# Altium schematic sheet SDEC944-xD_Ethernet.SchDoc: Ethernet
size 393 x 270 mm; CompanyName: Seccom; Address1: 521, rue du capt. François Garbit; Address2: 69440 Mornant; Address3: seccom@seccom.fr; Address4: www.seccom.fr; DocumentNumber: 6; SheetNumber: 6; SheetTotal: 22; PageSetup: Record=PageOptions|CenterHorizontal=True|CenterVertical=True|PrintScale=0.74|XCorrection=1.00|YCorrection=1.00|PrintKind=0|BorderSize=5000000|LeftOffset=0|BottomOffset=0|Orientation=2|PaperLength=1000|PaperWidth=1000|Scale=100|PaperSource=7|PrintQuality=-4|MediaType=1|DitherType=10|PaperKind=A4|PrintScaleMode=1
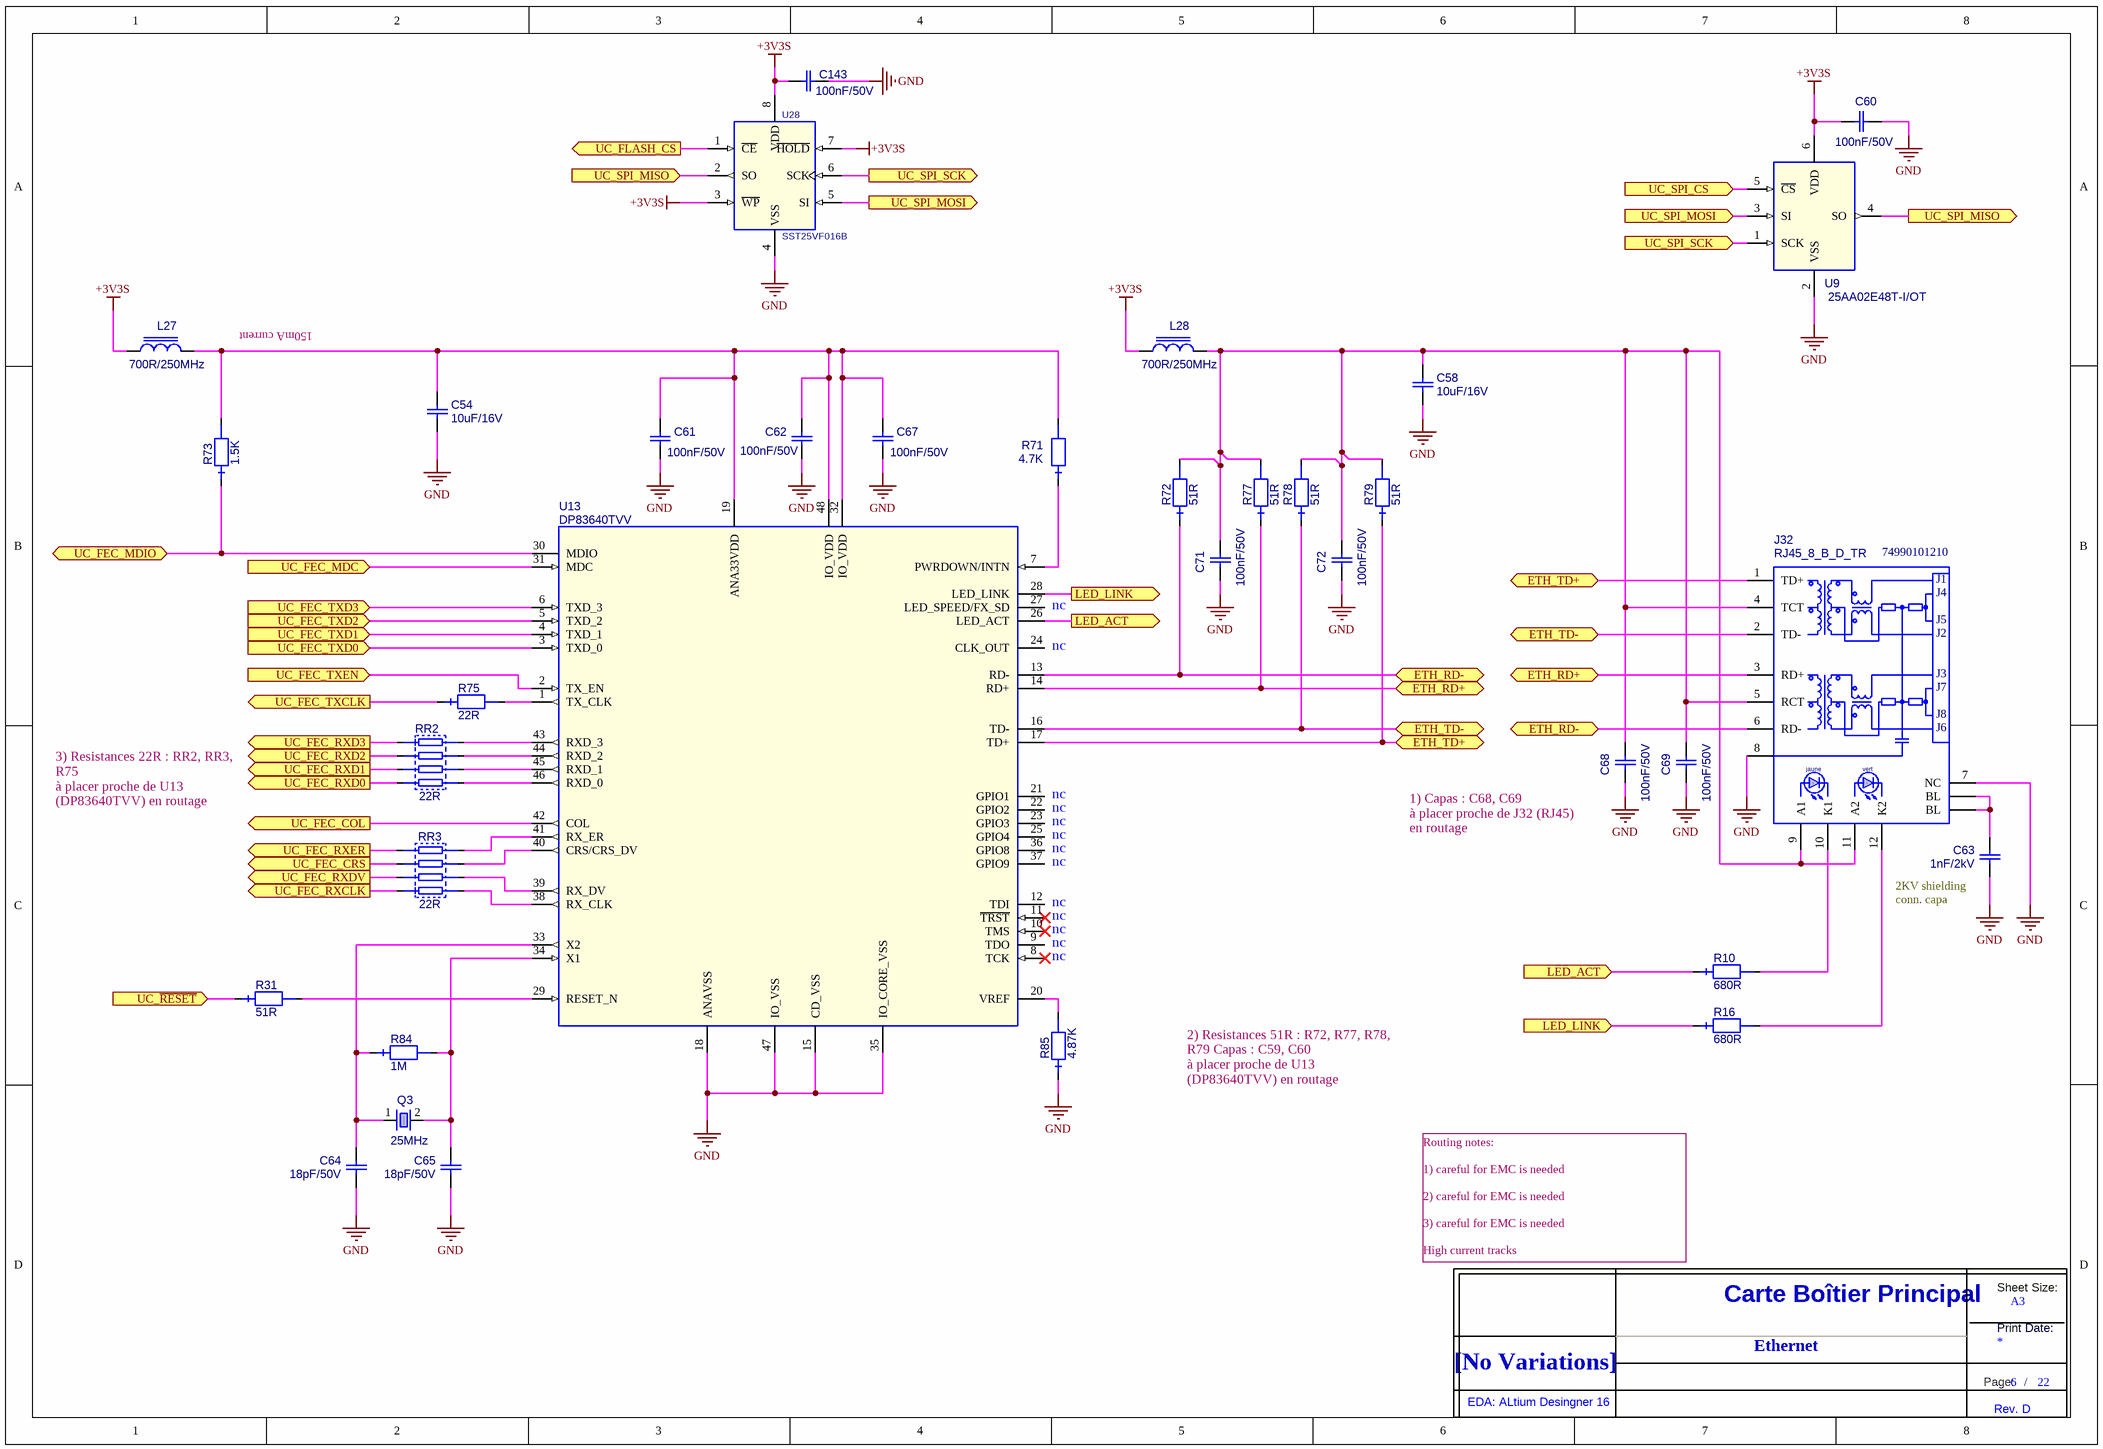
[diagram p0: SDEC944-xD_Ethernet.SchDoc]

## Parts
C54  value 10uF/16V  [0805_ReflowSoldering_CAP]  (hidden comment: C_0805_X5R_10%_10U-16V)
C58  value 10uF/16V  [0805_ReflowSoldering_CAP]  (hidden comment: C_0805_X5R_10%_10U-16V)
C60  value 100nF/50V  [0603_ReflowSoldering_CAP]  (hidden comment: C_0603_X7R_10%_100N-50V)
C61  value 100nF/50V  [0603_ReflowSoldering_CAP]  (hidden comment: C_0603_X7R_10%_100N-50V)
C62  value 100nF/50V  [0603_ReflowSoldering_CAP]  (hidden comment: C_0603_X7R_10%_100N-50V)
C63  value 1nF/2kV  [1206_ReflowSoldering_CAP]  (hidden comment: C_1206_X7R_10%_1N-2KV)
C64  value 18pF/50V  [0603_ReflowSoldering_CAP]  (hidden comment: C_0603_NPO_5%_18P-50V)
C65  value 18pF/50V  [0603_ReflowSoldering_CAP]  (hidden comment: C_0603_NPO_5%_18P-50V)
C67  value 100nF/50V  [0603_ReflowSoldering_CAP]  (hidden comment: C_0603_X7R_10%_100N-50V)
C68  value 100nF/50V  [0603_ReflowSoldering_CAP]  (hidden comment: C_0603_X7R_10%_100N-50V)
C69  value 100nF/50V  [0603_ReflowSoldering_CAP]  (hidden comment: C_0603_X7R_10%_100N-50V)
C71  value 100nF/50V  [0603_ReflowSoldering_CAP]  (hidden comment: C_0603_X7R_10%_100N-50V)
C72  value 100nF/50V  [0603_ReflowSoldering_CAP]  (hidden comment: C_0603_X7R_10%_100N-50V)
C143  value 100nF/50V  [0603_ReflowSoldering_CAP]  (hidden comment: C_0603_X7R_10%_100N-50V)
J32  value RJ45_8_B_D_TR  Ref Fab: 74990101210  [RJ45_8_B_D_TR_74990101210]  (hidden comment: PORT_ETH_10-100-BT_RJ45-8_B_D_LED_TR_74990101210)
L27  value 700R/250MHz  [0603_ReflowSoldering_CAP]  (hidden comment: IND_FERRITE_0603_742792643)
L28  value 700R/250MHz  [0603_ReflowSoldering_CAP]  (hidden comment: IND_FERRITE_0603_742792643)
Q3  value 25MHz  [QUARTZ_HC49_11.5X5_CMS]  (hidden comment: QUARTZ_HC49/4HSMX_25M)
R10  value 680R  [0603_ReflowSoldering_RES]  (hidden comment: RES_0603_1%_100PPM_680R)
R16  value 680R  [0603_ReflowSoldering_RES]  (hidden comment: RES_0603_1%_100PPM_680R)
R31  value 51R  [0603_ReflowSoldering_RES]  (hidden comment: RES_0603_1%_100PPM_51R)
R71  value 4.7K  [0603_ReflowSoldering_RES]  (hidden comment: RES_0603_1%_100PPM_4.7K)
R72  value 51R  [0603_ReflowSoldering_RES]  (hidden comment: RES_0603_1%_100PPM_51R)
R73  value 1.5K  [0603_ReflowSoldering_RES]  (hidden comment: RES_0603_1%_100PPM_1.5K)
R75  value 22R  [0603_ReflowSoldering_RES]  (hidden comment: RES_0603_1%_100PPM_22R)
R77  value 51R  [0603_ReflowSoldering_RES]  (hidden comment: RES_0603_1%_100PPM_51R)
R78  value 51R  [0603_ReflowSoldering_RES]  (hidden comment: RES_0603_1%_100PPM_51R)
R79  value 51R  [0603_ReflowSoldering_RES]  (hidden comment: RES_0603_1%_100PPM_51R)
R84  value 1M  [0603_ReflowSoldering_RES]  (hidden comment: RES_0603_1%_100PPM_1M)
R85  value 4.87K  [0603_ReflowSoldering_RES]  (hidden comment: RES_0603_1%_100PPM_4.87K)
RR2  value 22R  [ARV241]  (hidden comment: RES_4XR0603_IND_5%_22R*)
RR3  value 22R  [ARV241]  (hidden comment: RES_4XR0603_IND_5%_22R*)
Title_new  DNI  (value not drawn)  (graphical)
U9  25AA02E48T-I/OT  [SOT23_6L]
U13  DP83640TVV  [QFP_048_E0,50_7X7MM]
U28  value SST25VF016B  [SOIC_08_E1.27_L200_REFLOWSOLDERING]  (hidden comment: SST25VF016B-50-4I-S2AF)

## Ports
ETH_RD+ (bidir), ETH_RD- (bidir), ETH_TD+ (bidir), ETH_TD- (bidir), LED_ACT (in), LED_ACT (out), LED_LINK (in), LED_LINK (out), UC_FEC_COL (out), UC_FEC_CRS (out), UC_FEC_MDC (in), UC_FEC_MDIO (bidir), UC_FEC_RXCLK (out), UC_FEC_RXD0 (out), UC_FEC_RXD1 (out), UC_FEC_RXD2 (out), UC_FEC_RXD3 (out), UC_FEC_RXDV (out), UC_FEC_RXER (out), UC_FEC_TXCLK (out), UC_FEC_TXD0 (in), UC_FEC_TXD1 (in), UC_FEC_TXD2 (in), UC_FEC_TXD3 (in), UC_FEC_TXEN (in), UC_FLASH_CS (out), UC_SPI_CS (in), UC_SPI_MISO (in), UC_SPI_MISO (out), UC_SPI_MOSI (in), UC_SPI_MOSI (out), UC_SPI_SCK (in), UC_SPI_SCK (out), UC_~{RESET} (in)

## Nets
+3V3S: C60.1 C143.1 L27.1 L28.1 U9.6(VDD) U28.3(~{WP}) U28.7(~{HOLD}) U28.8(VDD)
GND: C54.1 C58.1 C60.2 C61.2 C62.2 C63.1 C64.1 C65.1 C67.2 C68.2 C69.2 C71.2 C72.2 C143.2 J32.7(NC) J32.8 R85.1 U9.2(VSS) U13.15(CD_VSS) U13.18(ANAVSS) U13.35(IO_CORE_VSS) U13.47(IO_VSS) U28.4(VSS)
ETH_RD+: J32.3(RD+) R77.1 U13.14(RD+) ; port ETH_RD+
ETH_RD-: J32.6(RD-) R72.1 U13.13(RD-) ; port ETH_RD-
ETH_TD+: J32.1(TD+) R79.1 U13.17(TD+) ; port ETH_TD+
ETH_TD-: J32.2(TD-) R78.1 U13.16(TD-) ; port ETH_TD-
LED_ACT: R10.1 U13.26(LED_ACT) ; port LED_ACT
LED_LINK: R16.1 U13.28(LED_LINK) ; port LED_LINK
UC_FEC_COL: U13.42(COL) ; port UC_FEC_COL
UC_FEC_CRS: RR3.5 ; port UC_FEC_CRS
UC_FEC_MDC: U13.31(MDC) ; port UC_FEC_MDC
UC_FEC_MDIO: R73.1 U13.30(MDIO) ; port UC_FEC_MDIO
UC_FEC_RXCLK: RR3.1 ; port UC_FEC_RXCLK
UC_FEC_RXD0: RR2.7 ; port UC_FEC_RXD0
UC_FEC_RXD1: RR2.5 ; port UC_FEC_RXD1
UC_FEC_RXD2: RR2.3 ; port UC_FEC_RXD2
UC_FEC_RXD3: RR2.1 ; port UC_FEC_RXD3
UC_FEC_RXDV: RR3.3 ; port UC_FEC_RXDV
UC_FEC_RXER: RR3.7 ; port UC_FEC_RXER
UC_FEC_TXCLK: R75.1 ; port UC_FEC_TXCLK
UC_FEC_TXD0: U13.3(TXD_0) ; port UC_FEC_TXD0
UC_FEC_TXD1: U13.4(TXD_1) ; port UC_FEC_TXD1
UC_FEC_TXD2: U13.5(TXD_2) ; port UC_FEC_TXD2
UC_FEC_TXD3: U13.6(TXD_3) ; port UC_FEC_TXD3
UC_FEC_TXEN: U13.2(TX_EN) ; port UC_FEC_TXEN
UC_FLASH_CS: U28.1(~{CE}) ; port UC_FLASH_CS
UC_~{RESET}: R31.1 ; port UC_~{RESET}
UC_SPI_CS: U9.5(~{CS}) ; port UC_SPI_CS
UC_SPI_MISO: U9.4(SO) U28.2(SO) ; port UC_SPI_MISO
UC_SPI_MOSI: U9.3(SI) U28.5(SI) ; port UC_SPI_MOSI
UC_SPI_SCK: U9.1(SCK) U28.6(SCK) ; port UC_SPI_SCK
NetC54_2: C54.2 C61.1 C62.1 C67.1 L27.2 R71.2 R73.2 U13.19(ANA33VDD) U13.32(IO_VDD) U13.48(IO_VDD)
NetC58_2: C58.2 C68.1 C69.1 C71.1 C72.1 J32.4(TCT) J32.5(RCT) J32.9(A1) J32.11(A2) L28.2 R72.2 R77.2 R78.2 R79.2
NetC63_2: C63.2 J32.FIX1(BL) J32.FIX2(BL)
NetC64_2: C64.2 Q3.1 R84.1 U13.33(X2)
NetC65_2: C65.2 Q3.2 R84.2 U13.34(X1)
NetJ32_10: J32.10(K1) R10.2
NetJ32_12: J32.12(K2) R16.2
NetR31_2: R31.2 U13.29(RESET_N)
NetR71_1: R71.1 U13.7(PWRDOWN/INTN)
NetR75_2: R75.2 U13.1(TX_CLK)
NetR85_2: R85.2 U13.20(VREF)
NetRR2_2: RR2.2 U13.43(RXD_3)
NetRR2_4: RR2.4 U13.44(RXD_2)
NetRR2_6: RR2.6 U13.45(RXD_1)
NetRR2_8: RR2.8 U13.46(RXD_0)
NetRR3_2: RR3.2 U13.38(RX_CLK)
NetRR3_4: RR3.4 U13.39(RX_DV)
NetRR3_6: RR3.6 U13.40(CRS/CRS_DV)
NetRR3_8: RR3.8 U13.41(RX_ER)

Not connected (* = marked no-connect by the designer): U13 8(TCK)* 9(TDO) 10(TMS)* 11(~{TRST})* 12(TDI) 21(GPIO1) 22(GPIO2) 23(GPIO3) 24(CLK_OUT) 25(GPIO4) 27(LED_SPEED/FX_SD) 36(GPIO8) 37(GPIO9)

## Notes on the sheet
- (near L27) 150mA current
- (near U13) nc
- 3) Resistances 22R : RR2, RR3, R75
  à placer proche de U13 (DP83640TVV) en routage
- (near C68) 1) Capas : C68, C69
  à placer proche de J32 (RJ45) en routage
- (near C63) 2KV shielding
  conn. capa
- 2) Resistances 51R : R72, R77, R78, R79 Capas : C59, C60
  à placer proche de U13 (DP83640TVV) en routage
- Routing notes:
  1) careful for EMC is needed
  2) careful for EMC is needed
  3) careful for EMC is needed
  High current tracks
- Ethernet
- (in symbol PORT_ETH_10-100-BT_RJ45-8_B_D_LED_TR_74990101210) J1; J4; J5; J2; J3; J7; J8; J6; jaune; vert
- (in symbol Title_new) Sheet Size:; Carte Boîtier Principal; A3; Print Date:; [No Variations]; Page:; /; EDA: ALtium Desingner 16; Rev. D

## Library data of the parts
C54 C58 = C_0805_X5R_10%_10U-16V: Condensateur céramique, X5R, 10%, CMS 0805, 10uF/16V; Creation: FB (02/10/12); Boitier: 0805; Remarque: {Remarque}; Coeff: 1; Fabricant: Kemet; Ref Fab: C0805C106K4PAC; Verification: *; ComponentLink1URL: O:\_Documentation\Datasheets\Kemet\Condos_Ceramic_CMS.pdf; ComponentLink2URL: o:\_Documentation\Datasheets\_Boitiers\PASSIF_CMS\RC_0805_(2x1,25)_(Schneider).pdf; Config: *; ComponentLink1Description: Datasheet; ComponentLink2Description: Datasheet Boitier
C60-C62 C67-C69 C71 C72 C143 = C_0603_X7R_10%_100N-50V: Condensateur céramique, X7R, 10%, CMS 0603, 100nF/50V; Creation: FB (29/02/12); Boitier: 0603; Remarque: {Remarque}; Fabricant: Kemet; Ref Fab: C0603C104K5RAC; Coeff: 1; ComponentLink1URL: O:\_Documentation\Datasheets\Kemet\Condos_Ceramic_CMS.pdf; ComponentLink2URL: o:\_Documentation\Datasheets\_BOITIERS\PASSIF_CMS\; Config: *; ComponentLink1Description: Datasheet; ComponentLink2Description: Datasheet Boitier; Supplier 1: Farnell; Supplier Part Number 1: 1288255
C63 = C_1206_X7R_10%_1N-2KV: Condensateur céramique, X7R, 10%, CMS 1206; Creation: LJ (29/06/10); Reference: 001425/00; Boitier: 1206; Remarque: {Remarque}; Coeff: 1; Fabricant: Kemet; Ref Fab: C1206C102KGRAC; ComponentLink1URL: O:\_Documentation\Datasheets\Kemet\Condos_Ceramic_HighVoltage_CMS.pdf; ComponentLink2URL: o:\_Documentation\Datasheets\_Boitiers\PASSIF_CMS\; Config: *; ComponentLink1Description: Datasheet; ComponentLink2Description: Datasheet Boitier
C64 C65 = C_0603_NPO_5%_18P-50V: Condensateur céramique, NPO, 5%, CMS 0603, 18pF/50V; Creation: FB (04/07/12); Boitier: 0603; Remarque: {Remarque}; Fabricant: Kemet; Ref Fab: C0603C180J5GAC; Coeff: 1; ComponentLink2URL: o:\_Documentation\Datasheets\_BOITIERS\PASSIF_CMS\; Config: *; ComponentLink1Description: Datasheet; ComponentLink2Description: Datasheet Boitier; Supplier 1: Farnell; Supplier Part Number 1: 1414620
J32 = PORT_ETH_10-100-BT_RJ45-8_B_D_LED_TR_74990101210: Embase RJ45 avec transformateur, 8/8 contacts + Led verte et jaune, blindée, droit, Viso 1.5kV; Creation: JPL (05/07/12); Coeff: 1; Fabricant: Wurth Electronik; Boitier: RJ45_8_B_D_TR; Config: *; ComponentLink1Description: Datasheet; ComponentLink2Description: Datasheet Boitier
L27 L28 = IND_FERRITE_0603_742792643: Inductance à ferrite multicouches CMS, imp=700R@250MHz, +/-25%, Rdc=350mR, I=400mA; Creation: PDP (02/08/12); Boitier: 0603; Coeff: 1; Fabricant: Wurth Elektronik; ComponentLink1URL: o:\_Documentation\Datasheets\Murata\Ferrite_BLM21P.pdf; Config: *; ComponentLink1Description: Datasheet; ComponentLink2Description: Datasheet Boitier; Ref Fab: 742792643; Supplier 1: Farnell; Supplier Part Number 1: 1800349
Q3 = QUARTZ_HC49/4HSMX_25M: Quartz CMS série HCM49 (équiv HC49/US), -10/+60°C, +/-30ppm, 18pF; Creation: LJ (11/03/09); Reference: 000495/00; Fabricant: Citizen; Ref Fab: HCM49 25.000MABJ-UT; Coeff: 1; Verification: *; Boitier: HC49/4HSMX; Remarque: *; ComponentLink1URL: O:\_Documentation\Datasheets\Citizen\Quartz_HC49-US_HCM49.pdf; ComponentLink2URL: o:\_Documentation\Datasheets\_BOITIERS\; Config: *; ComponentLink1Description: Datasheet; ComponentLink2Description: Datasheet Boitier; Supplier 1: Farnell; Supplier 2: Mouser; Supplier Part Number 1: 1457105; Supplier Part Number 2: 695-HCM49-25-U
R10 R16 = RES_0603_1%_100PPM_680R: Résistance, 0.100W, 1%, 100ppm, 75V, 680R; Creation: FB (02/08/12); Boitier: 0603; Remarque: {Remarque}; Fabricant: Vishay; Ref Fab: CRCW0603680RFKEA; Coeff: 1; Verification: *; ComponentLink1URL: O:\_Documentation\Datasheets\Vishay\Resistances_D-CRCWe3.pdf; ComponentLink2URL: o:\_Documentation\Datasheets\_BOITIERS\PASSIF_CMS\; Config: *; ComponentLink1Description: Datasheet; ComponentLink2Description: Datasheet Boitier; Supplier 1: Farnell; Supplier Part Number 1: 1469834; Supplier 2: Mouser; Supplier Part Number 2: 71-CRCW0603-680-E3
R31 R72 R77-R79 = RES_0603_1%_100PPM_51R: Résistance, 0.100W, 1%, 100ppm, 75V, 51R; Creation: JPL (05/07/12); Boitier: 0603; Remarque: {Remarque}; Fabricant: Vishay; Ref Fab: CRCW060351R0FKEA; Coeff: 1; Verification: *; ComponentLink1URL: O:\_Documentation\Datasheets\Vishay\Resistances_D-CRCWe3.pdf; ComponentLink2URL: o:\_Documentation\Datasheets\_BOITIERS\PASSIF_CMS\; Config: *; ComponentLink1Description: Datasheet; ComponentLink2Description: Datasheet Boitier; Supplier 1: Farnell; Supplier 2: Mouser; Supplier Part Number 1: 1652889; Supplier Part Number 2: 71-CRCW0603-51-E3
R71 = RES_0603_1%_100PPM_4.7K: Résistance, 0.100W, 1%, 100ppm, 75V, 4.7K; Creation: JPL (05/07/12); Boitier: 0603; Remarque: {Remarque}; Fabricant: Vishay; Ref Fab: CRCW06034K70FKEA; Coeff: 1; Verification: *; ComponentLink1URL: O:\_Documentation\Datasheets\Vishay\Resistances_D-CRCWe3.pdf; ComponentLink2URL: o:\_Documentation\Datasheets\_BOITIERS\PASSIF_CMS\; Config: *; ComponentLink1Description: Datasheet; ComponentLink2Description: Datasheet Boitier; Supplier 1: Farnell; Supplier 2: RadioSpares; Supplier Part Number 1: 1469807; Supplier Part Number 2: 6790484
R73 = RES_0603_1%_100PPM_1.5K: Résistance, 0.100W, 1%, 100ppm, 75V, 1.5K; Creation: JPL (05/07/12); Boitier: 0603; Remarque: {Remarque}; Fabricant: Vishay; Ref Fab: CRCW06031K50FKEA; Coeff: 1; Verification: *; ComponentLink1URL: O:\_Documentation\Datasheets\Vishay\Resistances_D-CRCWe3.pdf; ComponentLink2URL: o:\_Documentation\Datasheets\_BOITIERS\PASSIF_CMS\; Config: *; ComponentLink1Description: Datasheet; ComponentLink2Description: Datasheet Boitier; Supplier 1: Farnell; Supplier 2: RadioSpares; Supplier Part Number 1: 1469743; Supplier Part Number 2: 6789908
R75 = RES_0603_1%_100PPM_22R: Résistance, 0.100W, 1%, 100ppm, 75V, 22R; Creation: FB (05/07/12); Boitier: 0603; Remarque: {Remarque}; Fabricant: Vishay; Ref Fab: CRCW060322R0FKEA; Coeff: 1; Verification: *; ComponentLink1URL: O:\_Documentation\Datasheets\Vishay\Resistances_D-CRCWe3.pdf; ComponentLink2URL: o:\_Documentation\Datasheets\_BOITIERS\PASSIF_CMS\; Config: *; ComponentLink1Description: Datasheet; ComponentLink2Description: Datasheet Boitier; Supplier 1: Farnell; Supplier Part Number 1: 1469781
R84 = RES_0603_1%_100PPM_1M: Résistance, 0.100W, 1%, 100ppm, 75V, 1M; Creation: FB (04/07/12); Boitier: 0603; Remarque: {Remarque}; Fabricant: Vishay; Ref Fab: CRCW06031M00FKEA; Coeff: 1; Verification: *; ComponentLink1URL: O:\_Documentation\Datasheets\Vishay\Resistances_D-CRCWe3.pdf; ComponentLink2URL: o:\_Documentation\Datasheets\_BOITIERS\PASSIF_CMS\; Config: *; ComponentLink1Description: Datasheet; ComponentLink2Description: Datasheet Boitier; Supplier 1: Farnell; Supplier Part Number 1: 1469746
R85 = RES_0603_1%_100PPM_4.87K: Résistance, 0.100W, 1%, 100ppm, 75V, 4.87K; Creation: JPL (05/07/12); Boitier: 0603; Remarque: {Remarque}; Fabricant: Vishay; Ref Fab: CRCW06034K87FKEA; Coeff: 1; Verification: *; ComponentLink1URL: O:\_Documentation\Datasheets\Vishay\Resistances_D-CRCWe3.pdf; ComponentLink2URL: o:\_Documentation\Datasheets\_BOITIERS\PASSIF_CMS\; Config: *; ComponentLink1Description: Datasheet; ComponentLink2Description: Datasheet Boitier; Supplier 1: Farnell; Supplier 2: RadioSpares; Supplier Part Number 1: 1692529; Supplier Part Number 2: 6790481
RR2 RR3 = RES_4XR0603_IND_5%_22R*: Réseau de 4 résistances 0603 individuels, 63mW, 5%, CONCAVE / CONVEXE, CMS 1206; Creation: CHD; Reference: 001805/00; Boitier: ARx241; Remarque: {Remarque}; Verification: LJ (07/02/12); Coeff: 1; Fabricant: Yageo; Ref Fab: YC164-JR-0722RL; ComponentLink1URL: o:\_Documentation\Datasheets\Phycomp\ARC-ARV241-242.PDF; ComponentLink2URL: o:\_Documentation\Datasheets\_BOITIERS\; Config: *; ComponentLink1Description: Datasheet; ComponentLink2Description: Datasheet Boitier; Supplier 1: Farnell; Supplier Part Number 1: 9234411
Title_new = Title_new
U9 = 25AA02E48T-I/OT: EEPROM, avec identifiant EUI-48 (adresse MAC), 2kbits, Vs=1.8~5.5V, 10MHz, CMS; Creation: CHD(10/03/09); Verification: LJ; Reference: 000492/00; Coeff: 1; Fabricant: Microchip; Boitier: SOT23_6L; Remarque: *; ComponentLink1URL: o:\_Documentation\Datasheets\MicroChip\25AA02E48.pdf; ComponentLink2URL: o:\_Documentation\Datasheets\_Boitiers\ACTIF_CMS\SOT & TSOT\SOT23_6_(Schneider).pdf; Config: *; ComponentLink1Description: Datasheet; ComponentLink2Description: Datasheet Boitier; Ref Fab: 25AA02E48T-I/OT; Value: 25AA02E48T-I/OT
U13 = DP83640TVV: DP83640 Precision PHYTER - IEEE 1588 Precision Time Protocol Transceiver; Creation: FB (05/07/12); Boitier: LQFP48_e0.50_7x7mm; Remarque: {Remarque}; Coeff: 1; Fabricant: National Semiconductor; Ref Fab: DP83640TVV; ComponentLink1Description: Datasheet; ComponentLink1URL: o:\_Documentation\Datasheets\; ComponentLink2Description: Datasheet Boitier; ComponentLink2URL: o:\_Documentation\Datasheets\_BOITIERS\; Supplier 1: Farnell; Supplier Part Number 1: 1850292; Value: DP83640TVV
U28 = SST25VF016B-50-4I-S2AF: Mémoire Flash SPI, 2MBit, 50MHz, Vs=2.7~3.6V, -40/+85°C, CMS; Creation: PDP (23/04/13); Boitier: SO8_L200; Coeff: 1; Fabricant: Microchip; Verification: *; ComponentLink1URL: O:\_Documentation\Datasheets\MicroChip\SST25VF016B.pdf; ComponentLink2URL: O:\_Documentation\Datasheets\MicroChip\SST25VF016B.pdf; ComponentLink1Description: Datasheet; ComponentLink2Description: Datasheet Boitier; Ref Fab: SST25VF016B-50-4I-S2AF; Supplier 1: Farnell; Supplier Part Number 1: 1368695; Supplier 2: Mouser; Supplier Part Number 2: 579-25VF016B5IS2AF